# EAGLE design CHRMN-PROT-SHIELD (EAGLE 7.3.0)
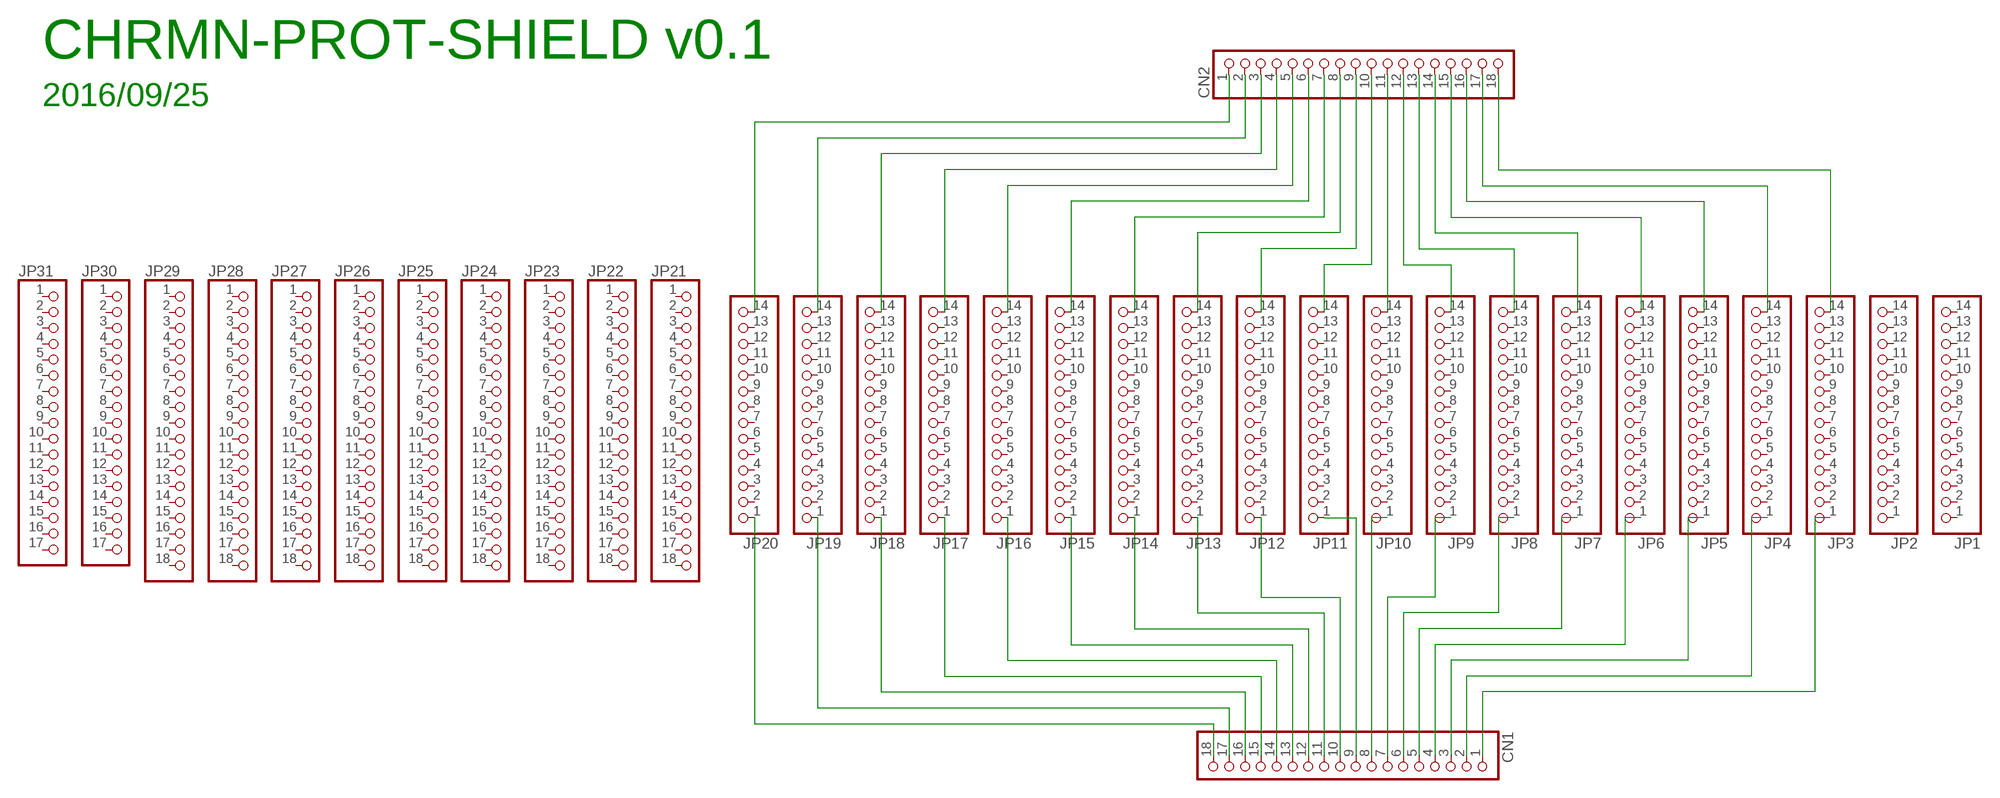
[diagram p0: schematic, sheet 1]

## Parts
CN1  PINHD-1X18  [1X18]
CN2  PINHD-1X18  [1X18]
JP1  PINHD-1X141X14-N  [N-PHEAD-1_14]
JP2  PINHD-1X141X14-N  [N-PHEAD-1_14]
JP3  PINHD-1X141X14-N  [N-PHEAD-1_14]
JP4  PINHD-1X141X14-N  [N-PHEAD-1_14]
JP5  PINHD-1X141X14-N  [N-PHEAD-1_14]
JP6  PINHD-1X141X14-N  [N-PHEAD-1_14]
JP7  PINHD-1X141X14-N  [N-PHEAD-1_14]
JP8  PINHD-1X141X14-N  [N-PHEAD-1_14]
JP9  PINHD-1X141X14-N  [N-PHEAD-1_14]
JP10  PINHD-1X141X14-N  [N-PHEAD-1_14]
JP11  PINHD-1X141X14-N  [N-PHEAD-1_14]
JP12  PINHD-1X141X14-N  [N-PHEAD-1_14]
JP13  PINHD-1X141X14-N  [N-PHEAD-1_14]
JP14  PINHD-1X141X14-N  [N-PHEAD-1_14]
JP15  PINHD-1X141X14-N  [N-PHEAD-1_14]
JP16  PINHD-1X141X14-N  [N-PHEAD-1_14]
JP17  PINHD-1X141X14-N  [N-PHEAD-1_14]
JP18  PINHD-1X141X14-N  [N-PHEAD-1_14]
JP19  PINHD-1X141X14-N  [N-PHEAD-1_14]
JP20  PINHD-1X141X14-N  [N-PHEAD-1_14]
JP21  PINHD-1X181X18-N  [N-PHEAD-1_18]
JP22  PINHD-1X181X18-N  [N-PHEAD-1_18]
JP23  PINHD-1X181X18-N  [N-PHEAD-1_18]
JP24  PINHD-1X181X18-N  [N-PHEAD-1_18]
JP25  PINHD-1X181X18-N  [N-PHEAD-1_18]
JP26  PINHD-1X181X18-N  [N-PHEAD-1_18]
JP27  PINHD-1X181X18-N  [N-PHEAD-1_18]
JP28  PINHD-1X181X18-N  [N-PHEAD-1_18]
JP29  PINHD-1X181X18-N  [N-PHEAD-1_18]
JP30  PINHD-1X171X17N  [N-PHEAD-1_17]
JP31  PINHD-1X171X17N  [N-PHEAD-1_17]

## Nets
N$1: CN2.18 JP3.14
N$2: CN2.17 JP4.14
N$3: CN2.16 JP5.14
N$4: CN2.15 JP6.14
N$5: CN2.14 JP7.14
N$6: CN2.13 JP8.14
N$7: CN2.12 JP9.14
N$8: CN2.11 JP10.14
N$9: CN2.10 JP11.14
N$10: CN2.9 JP12.14
N$11: CN2.8 JP13.14
N$12: CN2.7 JP14.14
N$13: CN2.6 JP15.14
N$14: CN2.5 JP16.14
N$15: CN2.4 JP17.14
N$16: CN2.3 JP18.14
N$17: CN2.2 JP19.14
N$18: CN2.1 JP20.14
N$19: CN1.1 JP3.1
N$20: CN1.2 JP4.1
N$21: CN1.3 JP5.1
N$22: CN1.4 JP6.1
N$23: CN1.5 JP7.1
N$24: CN1.6 JP8.1
N$25: CN1.7 JP9.1
N$26: CN1.8 JP10.1
N$27: CN1.9 JP11.1
N$28: CN1.10 JP12.1
N$29: CN1.11 JP13.1
N$30: CN1.12 JP14.1
N$31: CN1.13 JP15.1
N$32: CN1.14 JP16.1
N$33: CN1.15 JP17.1
N$34: CN1.16 JP18.1
N$35: CN1.17 JP19.1
N$36: CN1.18 JP20.1
Unconnected: JP1.1 JP1.2 JP1.3 JP1.4 JP1.5 JP1.6 JP1.7 JP1.8 JP1.9 JP1.10 JP1.11 JP1.12 JP1.13 JP1.14 JP2.1 JP2.2 JP2.3 JP2.4 JP2.5 JP2.6 JP2.7 JP2.8 JP2.9 JP2.10 JP2.11 JP2.12 JP2.13 JP2.14 JP3.2 JP3.3 JP3.4 JP3.5 JP3.6 JP3.7 JP3.8 JP3.9 JP3.10 JP3.11 JP3.12 JP3.13 JP4.2 JP4.3 JP4.4 JP4.5 JP4.6 JP4.7 JP4.8 JP4.9 JP4.10 JP4.11 JP4.12 JP4.13 JP5.2 JP5.3 JP5.4 JP5.5 JP5.6 JP5.7 JP5.8 JP5.9 JP5.10 JP5.11 JP5.12 JP5.13 JP6.2 JP6.3 JP6.4 JP6.5 JP6.6 JP6.7 JP6.8 JP6.9 JP6.10 JP6.11 JP6.12 JP6.13 JP7.2 JP7.3 JP7.4 JP7.5 JP7.6 JP7.7 JP7.8 JP7.9 JP7.10 JP7.11 JP7.12 JP7.13 JP8.2 JP8.3 JP8.4 JP8.5 JP8.6 JP8.7 JP8.8 JP8.9 JP8.10 JP8.11 JP8.12 JP8.13 JP9.2 JP9.3 JP9.4 JP9.5 JP9.6 JP9.7 JP9.8 JP9.9 JP9.10 JP9.11 JP9.12 JP9.13 JP10.2 JP10.3 JP10.4 JP10.5 JP10.6 JP10.7 JP10.8 JP10.9 JP10.10 JP10.11 JP10.12 JP10.13 JP11.2 JP11.3 JP11.4 JP11.5 JP11.6 JP11.7 JP11.8 JP11.9 JP11.10 JP11.11 JP11.12 JP11.13 JP12.2 JP12.3 JP12.4 JP12.5 JP12.6 JP12.7 JP12.8 JP12.9 JP12.10 JP12.11 JP12.12 JP12.13 JP13.2 JP13.3 JP13.4 JP13.5 JP13.6 JP13.7 JP13.8 JP13.9 JP13.10 JP13.11 JP13.12 JP13.13 JP14.2 JP14.3 JP14.4 JP14.5 JP14.6 JP14.7 JP14.8 JP14.9 JP14.10 JP14.11 JP14.12 JP14.13 JP15.2 JP15.3 JP15.4 JP15.5 JP15.6 JP15.7 JP15.8 JP15.9 JP15.10 JP15.11 JP15.12 JP15.13 JP16.2 JP16.3 JP16.4 JP16.5 JP16.6 JP16.7 JP16.8 JP16.9 JP16.10 JP16.11 JP16.12 JP16.13 JP17.2 JP17.3 JP17.4 JP17.5 JP17.6 JP17.7 JP17.8 JP17.9 JP17.10 JP17.11 JP17.12 JP17.13 JP18.2 JP18.3 JP18.4 JP18.5 JP18.6 JP18.7 JP18.8 JP18.9 JP18.10 JP18.11 JP18.12 JP18.13 JP19.2 JP19.3 JP19.4 JP19.5 JP19.6 JP19.7 JP19.8 JP19.9 JP19.10 JP19.11 JP19.12 JP19.13 JP20.2 JP20.3 JP20.4 JP20.5 JP20.6 JP20.7 JP20.8 JP20.9 JP20.10 JP20.11 JP20.12 JP20.13 JP21.1 JP21.2 JP21.3 JP21.4 JP21.5 JP21.6 JP21.7 JP21.8 JP21.9 JP21.10 JP21.11 JP21.12 JP21.13 JP21.14 JP21.15 JP21.16 JP21.17 JP21.18 JP22.1 JP22.2 JP22.3 JP22.4 JP22.5 JP22.6 JP22.7 JP22.8 JP22.9 JP22.10 JP22.11 JP22.12 JP22.13 JP22.14 JP22.15 JP22.16 JP22.17 JP22.18 JP23.1 JP23.2 JP23.3 JP23.4 JP23.5 JP23.6 JP23.7 JP23.8 JP23.9 JP23.10 JP23.11 JP23.12 JP23.13 JP23.14 JP23.15 JP23.16 JP23.17 JP23.18 JP24.1 JP24.2 JP24.3 JP24.4 JP24.5 JP24.6 JP24.7 JP24.8 JP24.9 JP24.10 JP24.11 JP24.12 JP24.13 JP24.14 JP24.15 JP24.16 JP24.17 JP24.18 JP25.1 JP25.2 JP25.3 JP25.4 JP25.5 JP25.6 JP25.7 JP25.8 JP25.9 JP25.10 JP25.11 JP25.12 JP25.13 JP25.14 JP25.15 JP25.16 JP25.17 JP25.18 JP26.1 JP26.2 JP26.3 JP26.4 JP26.5 JP26.6 JP26.7 JP26.8 JP26.9 JP26.10 JP26.11 JP26.12 JP26.13 JP26.14 JP26.15 JP26.16 JP26.17 JP26.18 JP27.1 JP27.2 JP27.3 JP27.4 JP27.5 JP27.6 JP27.7 JP27.8 JP27.9 JP27.10 JP27.11 JP27.12 JP27.13 JP27.14 JP27.15 JP27.16 JP27.17 JP27.18 JP28.1 JP28.2 JP28.3 JP28.4 JP28.5 JP28.6 JP28.7 JP28.8 JP28.9 JP28.10 JP28.11 JP28.12 JP28.13 JP28.14 JP28.15 JP28.16 JP28.17 JP28.18 JP29.1 JP29.2 JP29.3 JP29.4 JP29.5 JP29.6 JP29.7 JP29.8 JP29.9 JP29.10 JP29.11 JP29.12 JP29.13 JP29.14 JP29.15 JP29.16 JP29.17 JP29.18 JP30.1 JP30.2 JP30.3 JP30.4 JP30.5 JP30.6 JP30.7 JP30.8 JP30.9 JP30.10 JP30.11 JP30.12 JP30.13 JP30.14 JP30.15 JP30.16 JP30.17 JP31.1 JP31.2 JP31.3 JP31.4 JP31.5 JP31.6 JP31.7 JP31.8 JP31.9 JP31.10 JP31.11 JP31.12 JP31.13 JP31.14 JP31.15 JP31.16 JP31.17

## Notes on the sheet
- CHRMN-PROT-SHIELD v0.1
- 2016/09/25

## Library data of the parts
CN1 CN2 = pinhead:PINHD-1X18: PIN HEADER
JP1-JP20 = 0my:PINHD-1X14: PIN HEADER
JP21-JP29 = 0my:PINHD-1X18: PIN HEADER
JP30 JP31 = 0my:PINHD-1X17: PIN HEADER

## Net classes
0 default: width 0.61 mm, drill 0.203 mm, clearance 0.203 mm

## Board
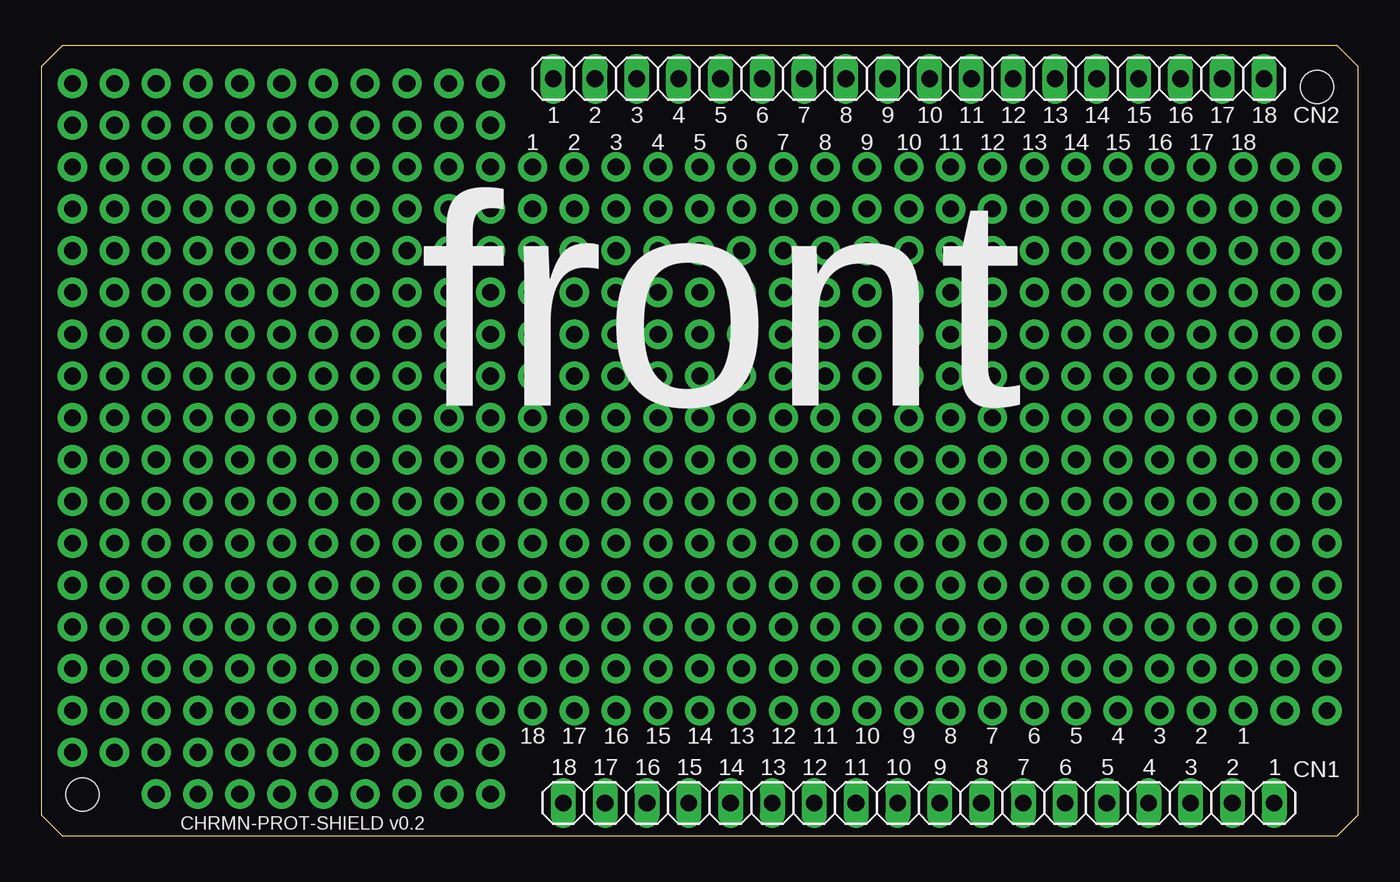
[diagram p1: board, top side]
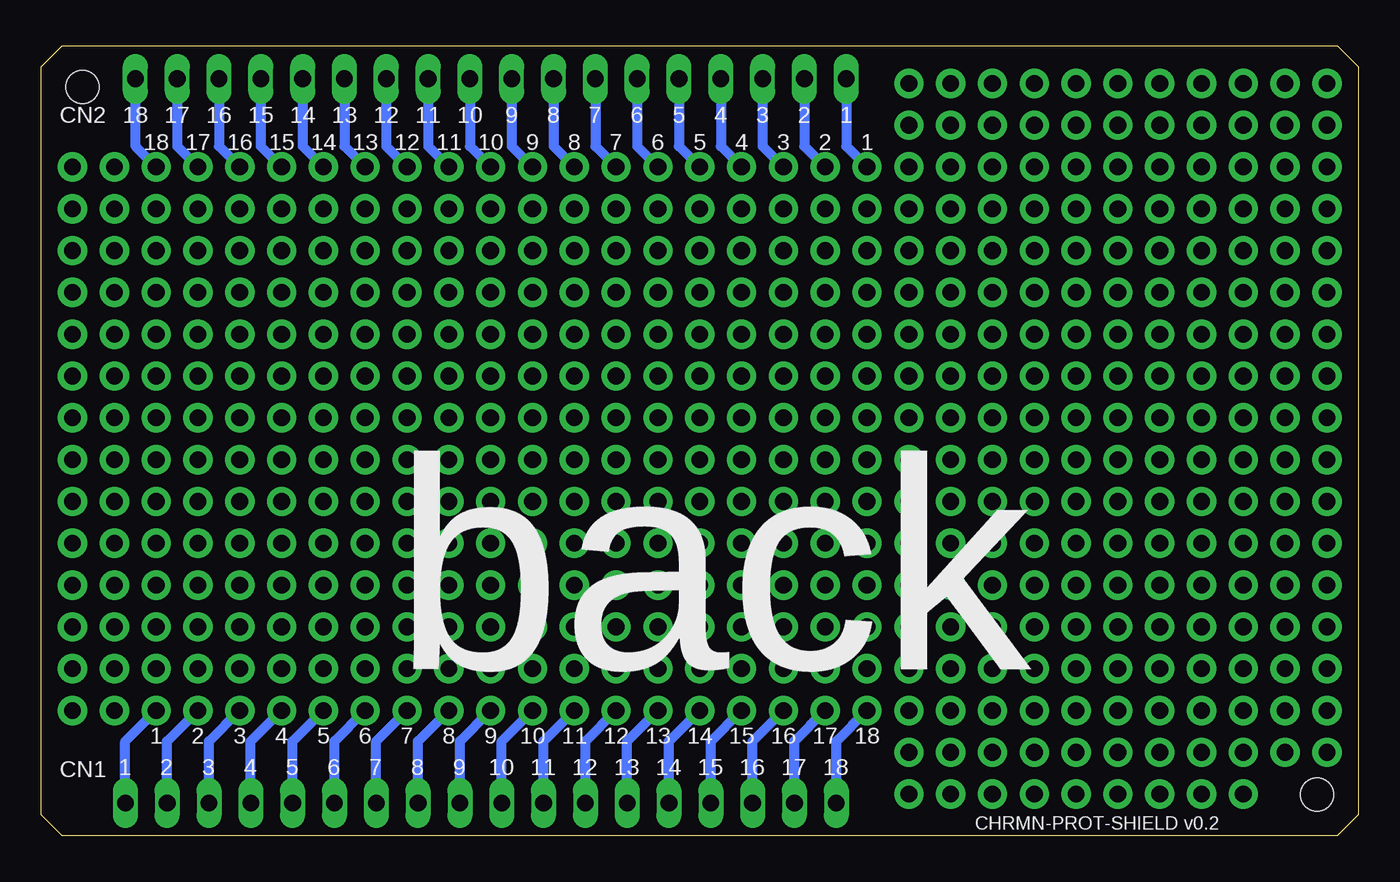
[diagram p2: board, bottom side, seen from below]

Size 80.01 x 48.01 mm. Coordinates in mm from the lower left corner, seen from the top.
Outline: 80.01,1.27 80.01,46.74 78.74,48.01 1.27,48.01 0,46.74 0,1.27 1.27,0 78.74,0 80.01,1.27
Copper layers (1*16): Top 0.035mm / dielectric 1.5mm / Bottom 0.035mm
Design rules "default": minimum track width 10mil, minimum drill 24mil, track to track 8mil, track to pad 8mil, pad to pad 8mil, via to via 8mil, smd to smd 8mil, copper to edge 40mil, drill to drill 8mil, minimum pad ring 10mil, minimum via ring 8mil, stop-mask expansion 4mil, vias tented up to drill 0mil, thermal gap 10mil
Holes 2 mm at 77.5,45.5 2.5,2.5

### Footprints (pad centres in the part's own frame; a part is rotated, then mirrored left to right if it is on the bottom)
1X18 = drill 1.016 long: 1 -21.59,0; 2 -19.05,0; 3 -16.51,0; 4 -13.97,0; 5 -11.43,0; 6 -8.89,0; 7 -6.35,0; 8 -3.81,0; 9 -1.27,0; 10 1.27,0; 11 3.81,0; 12 6.35,0; 13 8.89,0; 14 11.43,0; 15 13.97,0; 16 16.51,0; 17 19.05,0; 18 21.59,0
N-PHEAD-1_14 = drill 1.016 pad 1.778: 1 -16.51,0; 2 -13.97,0; 3 -11.43,0; 4 -8.89,0; 5 -6.35,0; 6 -3.81,0; 7 -1.27,0; 8 1.27,0; 9 3.81,0; 10 6.35,0; 11 8.89,0; 12 11.43,0; 13 13.97,0; 14 16.51,0
N-PHEAD-1_18 = drill 1.016 pad 1.778: 1 -16.51,0; 2 -13.97,0; 3 -11.43,0; 4 -8.89,0; 5 -6.35,0; 6 -3.81,0; 7 -1.27,0; 8 1.27,0; 9 3.81,0; 10 6.35,0; 11 8.89,0; 12 11.43,0; 13 13.97,0; 14 16.51,0; 15 -19.05,0; 16 -21.59,0; 17 19.05,0; 18 21.59,0
N-PHEAD-1_17 = drill 1.016 pad 1.778: 1 -15.24,0; 2 -12.7,0; 3 -10.16,0; 4 -7.62,0; 5 -5.08,0; 6 -2.54,0; 7 0,0; 8 2.54,0; 9 5.08,0; 10 7.62,0; 11 10.16,0; 12 12.7,0; 13 15.24,0; 14 17.78,0; 15 -17.78,0; 16 -20.32,0; 17 20.32,0

### Placement (x,y rotation side)
CN1  53.3,2 180 top
CN2  52.7,46 0 top
JP1  78.11,24.13 90 top
JP2  75.56,24.13 90 top
JP3  73.03,24.13 90 top
JP4  70.48,24.13 90 top
JP5  67.94,24.13 90 top
JP6  65.41,24.13 90 top
JP7  62.87,24.13 90 top
JP8  60.33,24.13 90 top
JP9  57.78,24.13 90 top
JP10  55.24,24.13 90 top
JP11  52.7,24.13 90 top
JP12  50.16,24.13 90 top
JP13  47.62,24.13 90 top
JP14  45.09,24.13 90 top
JP15  42.55,24.13 90 top
JP16  40.01,24.13 90 top
JP17  37.47,24.13 90 top
JP18  34.92,24.13 90 top
JP19  32.38,24.13 90 top
JP20  29.84,24.13 90 top
JP21  27.3,24.13 90 top
JP22  24.77,24.13 90 top
JP23  22.23,24.13 90 top
JP24  19.68,24.13 90 top
JP25  17.14,24.13 90 top
JP26  14.61,24.13 90 top
JP27  12.06,24.13 90 top
JP28  9.53,24.13 90 top
JP29  6.99,24.13 90 top
JP30  4.45,25.4 90 top
JP31  1.91,25.4 90 top

### Tracks (layer width: path | path; a pad name or v marks a point on that pad's centre or on a via)
N$1
  Bottom 0.61: CN2.18 74.28,43.19 74.3,43.18 74.3,41.91 JP3.14
N$2
  Bottom 0.61: CN2.17 71.75,41.9 JP4.14
N$3
  Bottom 0.61: CN2.16 69.2,41.9 JP5.14
N$4
  Bottom 0.61: CN2.15 66.67,41.9 JP6.14
N$5
  Bottom 0.61: CN2.14 64.12,41.9 JP7.14
N$6
  Bottom 0.61: CN2.13 61.59,41.9 JP8.14
N$7
  Bottom 0.61: CN2.12 59.05,41.9 JP9.14
N$8
  Bottom 0.61: CN2.11 56.51,41.9 JP10.14
N$9
  Bottom 0.61: CN2.10 53.97,41.9 JP11.14
N$10
  Bottom 0.61: CN2.9 51.42,41.9 JP12.14
N$11
  Bottom 0.61: CN2.8 48.88,41.9 JP13.14
N$12
  Bottom 0.61: CN2.7 46.34,41.9 JP14.14
N$13
  Bottom 0.61: CN2.6 43.8,41.9 JP15.14
N$14
  Bottom 0.61: CN2.5 41.27,41.9 JP16.14
N$15
  Bottom 0.61: CN2.4 38.73,41.9 JP17.14
N$16
  Bottom 0.61: CN2.3 36.19,41.9 JP18.14
N$17
  Bottom 0.61: CN2.2 33.65,41.9 JP19.14
N$18
  Bottom 0.61: CN2.1 31.11,41.9 JP20.14
N$19
  Bottom 0.61: CN1.1 74.89,5.75 JP3.1
N$20
  Bottom 0.61: CN1.2 72.36,5.75 JP4.1
N$21
  Bottom 0.61: CN1.3 69.81,5.75 JP5.1
N$22
  Bottom 0.61: CN1.4 67.28,5.75 JP6.1
N$23
  Bottom 0.61: CN1.5 64.73,5.75 JP7.1
N$24
  Bottom 0.61: CN1.6 62.2,5.75 JP8.1
N$25
  Bottom 0.61: CN1.7 59.66,5.75 JP9.1
N$26
  Bottom 0.61: CN1.8 57.12,5.75 JP10.1
N$27
  Bottom 0.61: CN1.9 54.58,5.75 JP11.1
N$28
  Bottom 0.61: CN1.10 52.03,5.75 JP12.1
N$29
  Bottom 0.61: CN1.11 49.49,5.75 JP13.1
N$30
  Bottom 0.61: CN1.12 46.95,5.75 JP14.1
N$31
  Bottom 0.61: CN1.13 44.41,5.75 JP15.1
N$32
  Bottom 0.61: CN1.14 41.88,5.75 JP16.1
N$33
  Bottom 0.61: CN1.15 39.34,5.75 JP17.1
N$34
  Bottom 0.61: CN1.16 36.8,5.75 JP18.1
N$35
  Bottom 0.61: CN1.17 34.26,5.75 JP19.1
N$36
  Bottom 0.61: CN1.18 31.71,5.75 JP20.1

### Text on the board
tNames: 1 | 2 | 3 | 4 | 5 | 6 | 7 | 8 | 9 | 10 | 11 | 12 | 13 | 14 | 15 | 16 | 17 | 18 | CN2 | 1 | 2 | 3 | 4 | 5 | 6 | 7 | 8 | 9 | 10 | 11 | 12 | 13 | 14 | 15 | 16 | 17 | 18 | front | 18 | 17 | 16 | 15 | 14 | 13 | 12 | 11 | 10 | 9 | 8 | 7 | 6 | 5 | 4 | 3 | 2 | 1 | 18 | 17 | 16 | 15 | 14 | 13 | 12 | 11 | 10 | 9 | 8 | 7 | 6 | 5 | 4 | 3 | 2 | 1 | CN1 | CHRMN-PROT-SHIELD v0.2
bNames: 1 | 2 | 3 | 4 | 5 | 6 | 7 | 8 | 9 | 10 | 11 | 12 | 13 | 14 | 15 | 16 | 17 | 18 | CN2 | 1 | 2 | 3 | 4 | 5 | 6 | 7 | 8 | 9 | 10 | 11 | 12 | 13 | 14 | 15 | 16 | 17 | 18 | back | 18 | 17 | 16 | 15 | 14 | 13 | 12 | 11 | 10 | 9 | 8 | 7 | 6 | 5 | 4 | 3 | 2 | 1 | 18 | 17 | 16 | 15 | 14 | 13 | 12 | 11 | 10 | 9 | 8 | 7 | 6 | 5 | 4 | 3 | 2 | 1 | CN1 | CHRMN-PROT-SHIELD v0.2